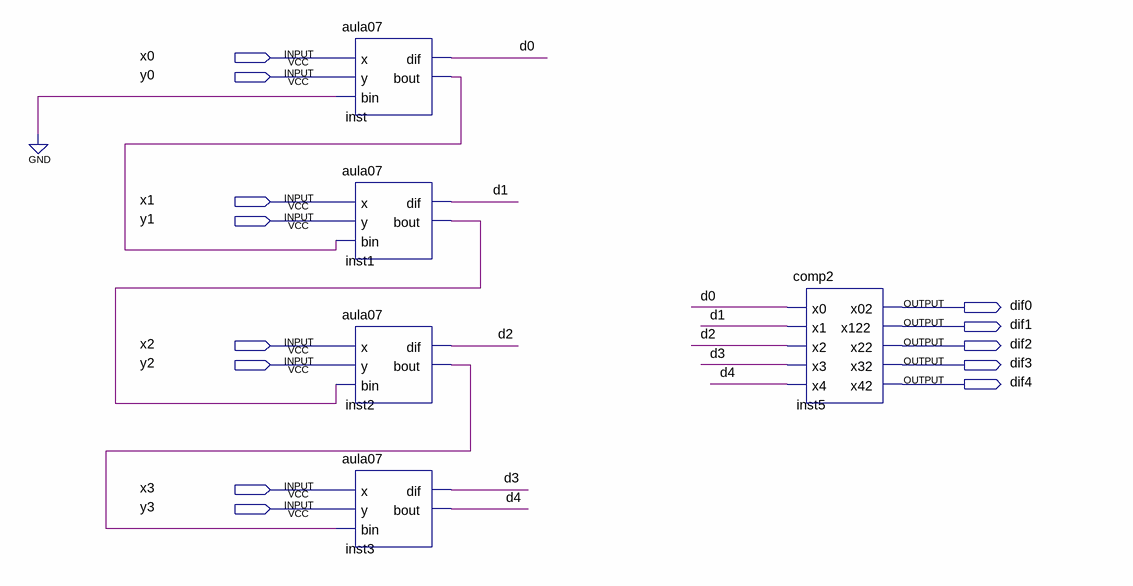
[diagram p0: schematic sheet]
// Quartus schematic sub4bits.bdf as structural Verilog: 5 symbols, 13 pins
module sub4bits (
  input  x0,
  input  y0,
  input  x1,
  input  y1,
  input  x2,
  input  y2,
  input  x3,
  input  y3,
  output dif0,
  output dif1,
  output dif2,
  output dif3,
  output dif4
);

  wire d0, d1, d2, d3, d4, inst1_bout, inst2_bout, inst_bout;

  aula07 inst (.x(x0), .y(y0), .bin(1'b0), .dif(d0), .bout(inst_bout));
  aula07 inst1 (.x(x1), .y(y1), .bin(inst_bout), .dif(d1), .bout(inst1_bout));
  aula07 inst2 (.x(x2), .y(y2), .bin(inst1_bout), .dif(d2), .bout(inst2_bout));
  aula07 inst3 (.x(x3), .y(y3), .bin(inst2_bout), .dif(d3), .bout(d4));
  comp2 inst5 (
    .x0(d0), .x1(d1), .x2(d2), .x3(d3), .x4(d4), .x02(dif0), .x122(dif1), .x22(dif2), .x32(dif3), .x42(dif4));
endmodule
